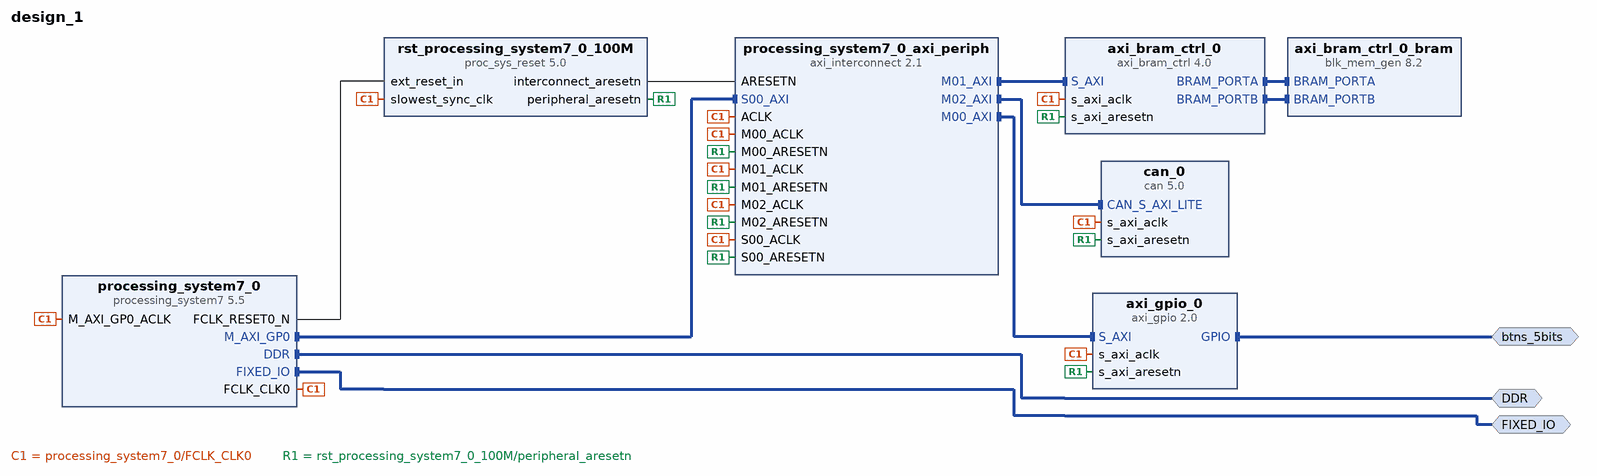
[diagram p0: block diagram of the top level]
# Vivado block design design_1, Vivado 2014.3.1
create_bd_design design_1

create_bd_intf_port -mode Master -vlnv xilinx.com:interface:ddrx_rtl:1.0 DDR
create_bd_intf_port -mode Master -vlnv xilinx.com:display_processing_system7:fixedio_rtl:1.0 FIXED_IO
create_bd_intf_port -mode Master -vlnv xilinx.com:interface:gpio_rtl:1.0 btns_5bits

create_bd_cell -type ip -vlnv xilinx.com:ip:processing_system7:5.5 processing_system7_0
set_property -dict {CONFIG.preset {ZedBoard*}} [get_bd_cells processing_system7_0]
create_bd_cell -type ip -vlnv xilinx.com:ip:axi_gpio:2.0 axi_gpio_0
set_property -dict {CONFIG.USE_BOARD_FLOW true CONFIG.GPIO_BOARD_INTERFACE btns_5bits} [get_bd_cells axi_gpio_0]
create_bd_cell -type ip -vlnv xilinx.com:ip:axi_interconnect:2.1 processing_system7_0_axi_periph
set_property -dict {CONFIG.NUM_MI 3} [get_bd_cells processing_system7_0_axi_periph]
create_bd_cell -type ip -vlnv xilinx.com:ip:proc_sys_reset:5.0 rst_processing_system7_0_100M
create_bd_cell -type ip -vlnv xilinx.com:ip:axi_bram_ctrl:4.0 axi_bram_ctrl_0
create_bd_cell -type ip -vlnv xilinx.com:ip:blk_mem_gen:8.2 axi_bram_ctrl_0_bram
set_property -dict {CONFIG.Memory_Type True_Dual_Port_RAM} [get_bd_cells axi_bram_ctrl_0_bram]
create_bd_cell -type ip -vlnv xilinx.com:ip:can:5.0 can_0

# ---- connections ----

connect_bd_intf_net [get_bd_intf_pins processing_system7_0/M_AXI_GP0] [get_bd_intf_pins processing_system7_0_axi_periph/S00_AXI]
connect_bd_intf_net [get_bd_intf_pins processing_system7_0_axi_periph/M00_AXI] [get_bd_intf_pins axi_gpio_0/S_AXI]
connect_bd_intf_net [get_bd_intf_pins processing_system7_0_axi_periph/M01_AXI] [get_bd_intf_pins axi_bram_ctrl_0/S_AXI]
connect_bd_intf_net [get_bd_intf_pins axi_bram_ctrl_0_bram/BRAM_PORTA] [get_bd_intf_pins axi_bram_ctrl_0/BRAM_PORTA]
connect_bd_intf_net [get_bd_intf_pins axi_bram_ctrl_0_bram/BRAM_PORTB] [get_bd_intf_pins axi_bram_ctrl_0/BRAM_PORTB]
connect_bd_intf_net [get_bd_intf_pins processing_system7_0_axi_periph/M02_AXI] [get_bd_intf_pins can_0/CAN_S_AXI_LITE]
connect_bd_intf_net [get_bd_intf_ports DDR] [get_bd_intf_pins processing_system7_0/DDR]
connect_bd_intf_net [get_bd_intf_ports FIXED_IO] [get_bd_intf_pins processing_system7_0/FIXED_IO]
connect_bd_intf_net [get_bd_intf_ports btns_5bits] [get_bd_intf_pins axi_gpio_0/GPIO]
connect_bd_net [get_bd_pins processing_system7_0/FCLK_CLK0] \
  [get_bd_pins processing_system7_0/M_AXI_GP0_ACLK] [get_bd_pins processing_system7_0_axi_periph/S00_ACLK] \
  [get_bd_pins rst_processing_system7_0_100M/slowest_sync_clk] [get_bd_pins processing_system7_0_axi_periph/ACLK] \
  [get_bd_pins axi_gpio_0/s_axi_aclk] [get_bd_pins processing_system7_0_axi_periph/M00_ACLK] \
  [get_bd_pins axi_bram_ctrl_0/s_axi_aclk] [get_bd_pins processing_system7_0_axi_periph/M01_ACLK] \
  [get_bd_pins can_0/s_axi_aclk] [get_bd_pins processing_system7_0_axi_periph/M02_ACLK]
connect_bd_net [get_bd_pins processing_system7_0/FCLK_RESET0_N] [get_bd_pins rst_processing_system7_0_100M/ext_reset_in]
connect_bd_net [get_bd_pins rst_processing_system7_0_100M/peripheral_aresetn] \
  [get_bd_pins processing_system7_0_axi_periph/S00_ARESETN] [get_bd_pins axi_gpio_0/s_axi_aresetn] \
  [get_bd_pins processing_system7_0_axi_periph/M00_ARESETN] [get_bd_pins axi_bram_ctrl_0/s_axi_aresetn] \
  [get_bd_pins processing_system7_0_axi_periph/M01_ARESETN] [get_bd_pins can_0/s_axi_aresetn] \
  [get_bd_pins processing_system7_0_axi_periph/M02_ARESETN]
connect_bd_net [get_bd_pins rst_processing_system7_0_100M/interconnect_aresetn] [get_bd_pins processing_system7_0_axi_periph/ARESETN]

# ---- address map ----
assign_bd_address -offset 0x40000000 -range 8K -target_address_space [get_bd_addr_spaces processing_system7_0/Data] [get_bd_addr_segs axi_bram_ctrl_0/S_AXI/Mem0]
assign_bd_address -offset 0x41200000 -range 64K -target_address_space [get_bd_addr_spaces processing_system7_0/Data] [get_bd_addr_segs axi_gpio_0/S_AXI/Reg]
assign_bd_address -offset 0x43C00000 -range 64K -target_address_space [get_bd_addr_spaces processing_system7_0/Data] [get_bd_addr_segs can_0/CAN_S_AXI_LITE/Reg]

validate_bd_design
save_bd_design
